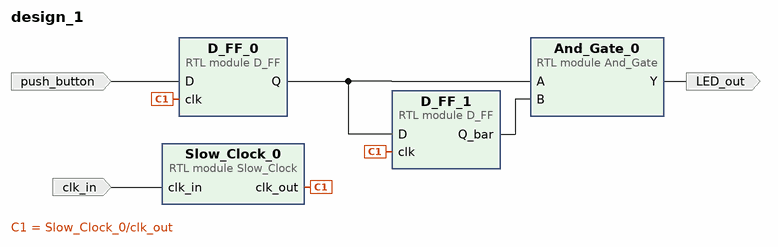
[diagram p0: block diagram of the top level]
# Vivado block design design_1, xc7a35tcpg236-1, Vivado 2021.1
create_bd_design design_1

create_bd_port -dir I clk_in
create_bd_port -dir I push_button
create_bd_port -dir O LED_out

create_bd_cell -type module -reference D_FF D_FF_0
create_bd_cell -type module -reference D_FF D_FF_1
create_bd_cell -type module -reference And_Gate And_Gate_0
create_bd_cell -type module -reference Slow_Clock Slow_Clock_0

# ---- connections ----

connect_bd_net [get_bd_pins And_Gate_0/Y] [get_bd_ports LED_out]
connect_bd_net [get_bd_pins D_FF_0/Q] [get_bd_pins D_FF_1/D] [get_bd_pins And_Gate_0/A]
connect_bd_net [get_bd_pins D_FF_1/Q_bar] [get_bd_pins And_Gate_0/B]
connect_bd_net [get_bd_pins Slow_Clock_0/clk_out] [get_bd_pins D_FF_0/clk] [get_bd_pins D_FF_1/clk]
connect_bd_net [get_bd_ports clk_in] [get_bd_pins Slow_Clock_0/clk_in]
connect_bd_net [get_bd_ports push_button] [get_bd_pins D_FF_0/D]

validate_bd_design
save_bd_design
